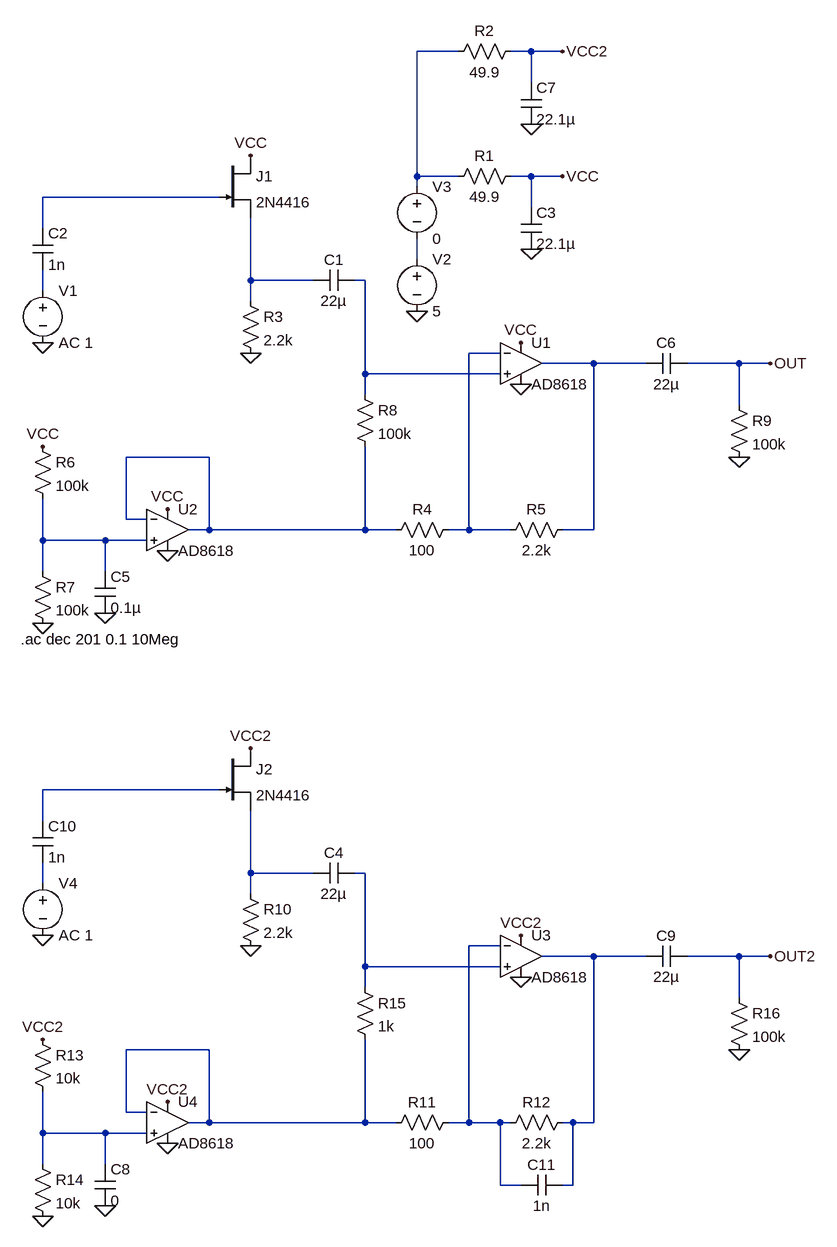
[diagram p0: schematic MIC_V1.asc]
MIC_V1.asc, the LTspice schematic file:
Version 4
SHEET 1 880 1544
WIRE 16 -288 -48 -288
WIRE 128 -288 96 -288
WIRE 176 -288 128 -288
WIRE 128 -240 128 -288
WIRE -48 -96 -48 -288
WIRE 16 -96 -48 -96
WIRE 128 -96 96 -96
WIRE 176 -96 128 -96
WIRE -48 -80 -48 -96
WIRE -352 -64 -624 -64
WIRE 128 -48 128 -96
WIRE -624 -16 -624 -64
WIRE -48 32 -48 0
WIRE -304 64 -304 -32
WIRE -208 64 -304 64
WIRE -128 64 -144 64
WIRE -624 80 -624 48
WIRE -304 96 -304 64
WIRE 80 176 32 176
WIRE 224 192 144 192
WIRE 304 192 224 192
WIRE 448 192 368 192
WIRE 496 192 448 192
WIRE -128 208 -128 64
WIRE 80 208 -128 208
WIRE -128 240 -128 208
WIRE 448 256 448 192
WIRE -368 336 -496 336
WIRE -496 432 -496 336
WIRE -464 432 -496 432
WIRE -368 448 -368 336
WIRE -368 448 -400 448
WIRE -128 448 -128 320
WIRE -128 448 -368 448
WIRE -80 448 -128 448
WIRE 32 448 32 176
WIRE 32 448 0 448
WIRE 96 448 32 448
WIRE 224 448 224 192
WIRE 224 448 176 448
WIRE -624 464 -624 400
WIRE -528 464 -624 464
WIRE -464 464 -528 464
WIRE -624 512 -624 464
WIRE -528 512 -528 464
WIRE -352 848 -624 848
WIRE -624 896 -624 848
WIRE -304 976 -304 880
WIRE -208 976 -304 976
WIRE -128 976 -144 976
WIRE -624 992 -624 960
WIRE -304 1008 -304 976
WIRE 80 1088 32 1088
WIRE 224 1104 144 1104
WIRE 304 1104 224 1104
WIRE 448 1104 368 1104
WIRE 496 1104 448 1104
WIRE -128 1120 -128 976
WIRE 80 1120 -128 1120
WIRE -128 1152 -128 1120
WIRE 448 1168 448 1104
WIRE -368 1248 -496 1248
WIRE -496 1344 -496 1248
WIRE -464 1344 -496 1344
WIRE -368 1360 -368 1248
WIRE -368 1360 -400 1360
WIRE -128 1360 -128 1232
WIRE -128 1360 -368 1360
WIRE -80 1360 -128 1360
WIRE 32 1360 32 1088
WIRE 32 1360 0 1360
WIRE 80 1360 32 1360
WIRE 96 1360 80 1360
WIRE 192 1360 176 1360
WIRE 224 1360 224 1104
WIRE 224 1360 192 1360
WIRE -624 1376 -624 1312
WIRE -528 1376 -624 1376
WIRE -464 1376 -528 1376
WIRE -624 1424 -624 1376
WIRE -528 1424 -528 1376
WIRE 80 1456 80 1360
WIRE 112 1456 80 1456
WIRE 192 1456 192 1360
WIRE 192 1456 176 1456
FLAG -624 160 0
FLAG 128 16 0
FLAG 176 -96 VCC
FLAG -432 416 VCC
FLAG 112 160 VCC
FLAG -48 112 0
FLAG -432 480 0
FLAG 112 224 0
FLAG -304 176 0
FLAG -624 592 0
FLAG -528 576 0
FLAG -624 320 VCC
FLAG 448 336 0
FLAG 496 192 OUT
FLAG -304 -128 VCC
FLAG -624 1072 0
FLAG -432 1328 VCC2
FLAG 112 1072 VCC2
FLAG -432 1392 0
FLAG 112 1136 0
FLAG -304 1088 0
FLAG -624 1504 0
FLAG -528 1488 0
FLAG -624 1232 VCC2
FLAG 448 1248 0
FLAG 496 1104 OUT2
FLAG -304 784 VCC2
FLAG 128 -176 0
FLAG 176 -288 VCC2
SYMBOL Opamps\\AD8618 112 128 R0
SYMATTR InstName U1
SYMBOL cap -144 48 R90
WINDOW 0 0 32 VBottom 2
WINDOW 3 32 32 VTop 2
SYMATTR InstName C1
SYMATTR Value 22µ
SYMBOL voltage -624 64 R0
WINDOW 123 0 0 Left 0
WINDOW 39 0 0 Left 0
SYMATTR InstName V1
SYMATTR Value AC 1
SYMBOL Opamps\\AD8618 -432 384 R0
SYMATTR InstName U2
SYMBOL voltage -48 16 R0
SYMATTR InstName V2
SYMATTR Value 5
SYMBOL res 112 -112 R90
WINDOW 0 0 56 VBottom 2
WINDOW 3 32 56 VTop 2
SYMATTR InstName R1
SYMATTR Value 49.9
SYMBOL cap 112 -48 R0
SYMATTR InstName C3
SYMATTR Value 22.1µ
SYMBOL res -320 80 R0
SYMATTR InstName R3
SYMATTR Value 2.2k
SYMBOL res 16 432 R90
WINDOW 0 0 56 VBottom 2
WINDOW 3 32 56 VTop 2
SYMATTR InstName R4
SYMATTR Value 100
SYMBOL res 192 432 R90
WINDOW 0 0 56 VBottom 2
WINDOW 3 32 56 VTop 2
SYMATTR InstName R5
SYMATTR Value 2.2k
SYMBOL res -640 304 R0
SYMATTR InstName R6
SYMATTR Value 100k
SYMBOL res -640 496 R0
SYMATTR InstName R7
SYMATTR Value 100k
SYMBOL cap -544 512 R0
SYMATTR InstName C5
SYMATTR Value 0.1µ
SYMBOL cap 368 176 R90
WINDOW 0 0 32 VBottom 2
WINDOW 3 32 32 VTop 2
SYMATTR InstName C6
SYMATTR Value 22µ
SYMBOL res -144 224 R0
SYMATTR InstName R8
SYMATTR Value 100k
SYMBOL res 432 240 R0
SYMATTR InstName R9
SYMATTR Value 100k
SYMBOL njf -352 -128 R0
SYMATTR InstName J1
SYMATTR Value 2N4416
SYMBOL cap -640 -16 R0
SYMATTR InstName C2
SYMATTR Value 1n
SYMBOL voltage -48 -96 R0
SYMATTR InstName V3
SYMATTR Value 0
SYMBOL Opamps\\AD8618 112 1040 R0
SYMATTR InstName U3
SYMBOL cap -144 960 R90
WINDOW 0 0 32 VBottom 2
WINDOW 3 32 32 VTop 2
SYMATTR InstName C4
SYMATTR Value 22µ
SYMBOL voltage -624 976 R0
WINDOW 123 0 0 Left 0
WINDOW 39 0 0 Left 0
SYMATTR InstName V4
SYMATTR Value AC 1
SYMBOL Opamps\\AD8618 -432 1296 R0
SYMATTR InstName U4
SYMBOL res -320 992 R0
SYMATTR InstName R10
SYMATTR Value 2.2k
SYMBOL res 16 1344 R90
WINDOW 0 0 56 VBottom 2
WINDOW 3 32 56 VTop 2
SYMATTR InstName R11
SYMATTR Value 100
SYMBOL res 192 1344 R90
WINDOW 0 0 56 VBottom 2
WINDOW 3 32 56 VTop 2
SYMATTR InstName R12
SYMATTR Value 2.2k
SYMBOL res -640 1216 R0
SYMATTR InstName R13
SYMATTR Value 10k
SYMBOL res -640 1408 R0
SYMATTR InstName R14
SYMATTR Value 10k
SYMBOL cap -544 1424 R0
SYMATTR InstName C8
SYMATTR Value 0
SYMBOL cap 368 1088 R90
WINDOW 0 0 32 VBottom 2
WINDOW 3 32 32 VTop 2
SYMATTR InstName C9
SYMATTR Value 22µ
SYMBOL res -144 1136 R0
SYMATTR InstName R15
SYMATTR Value 1k
SYMBOL res 432 1152 R0
SYMATTR InstName R16
SYMATTR Value 100k
SYMBOL njf -352 784 R0
SYMATTR InstName J2
SYMATTR Value 2N4416
SYMBOL cap -640 896 R0
SYMATTR InstName C10
SYMATTR Value 1n
SYMBOL res 112 -304 R90
WINDOW 0 0 56 VBottom 2
WINDOW 3 32 56 VTop 2
SYMATTR InstName R2
SYMATTR Value 49.9
SYMBOL cap 112 -240 R0
SYMATTR InstName C7
SYMATTR Value 22.1µ
SYMBOL cap 176 1440 R90
WINDOW 0 0 32 VBottom 2
WINDOW 3 32 32 VTop 2
SYMATTR InstName C11
SYMATTR Value 1n
TEXT -658 616 Left 2 !.ac dec 201 0.1 10Meg

The netlist it stands for:
* MIC_V1.asc
XU1 N005 N007 VCC 0 N008 AD8618  ; pins In+ In- V+ V- OUT
C1 N005 N004 22µ
V1 N006 0 AC 1
XU2 N010 N009 VCC 0 N009 AD8618  ; pins In+ In- V+ V- OUT
V2 N003 0 5
R1 VCC N001 49.9
C3 VCC 0 22.1µ
R3 N004 0 2.2k
R4 N007 N009 100
R5 N008 N007 2.2k
R6 VCC N010 100k
R7 N010 0 100k
C5 N010 0 0.1µ
C6 OUT N008 22µ
R8 N005 N009 100k
R9 OUT 0 100k
J1 VCC N002 N004 2N4416
C2 N002 N006 1n
V3 N001 N003 0
XU3 N013 N015 VCC2 0 N016 AD8618  ; pins In+ In- V+ V- OUT
C4 N013 N012 22µ
V4 N014 0 AC 1
XU4 N018 N017 VCC2 0 N017 AD8618  ; pins In+ In- V+ V- OUT
R10 N012 0 2.2k
R11 N015 N017 100
R12 N016 N015 2.2k
R13 VCC2 N018 10k
R14 N018 0 10k
C8 N018 0 0
C9 OUT2 N016 22µ
R15 N013 N017 1k
R16 OUT2 0 100k
J2 VCC2 N011 N012 2N4416
C10 N011 N014 1n
R2 VCC2 N001 49.9
C7 VCC2 0 22.1µ
C11 N016 N015 1n
.model NJF NJF
.model PJF PJF
.lib standard.jft
.ac dec 201 0.1 10Meg
.backanno
.end